# Altium schematic sheet eMMC.SchDoc: eMMC
size A3; CompanyName: STMicroelectronics; Address1: 12, Rue Jules HOROWITZ; Address2: 38019 Grenoble; Address3: FRANCE; SheetNumber: 6; SheetTotal: 7
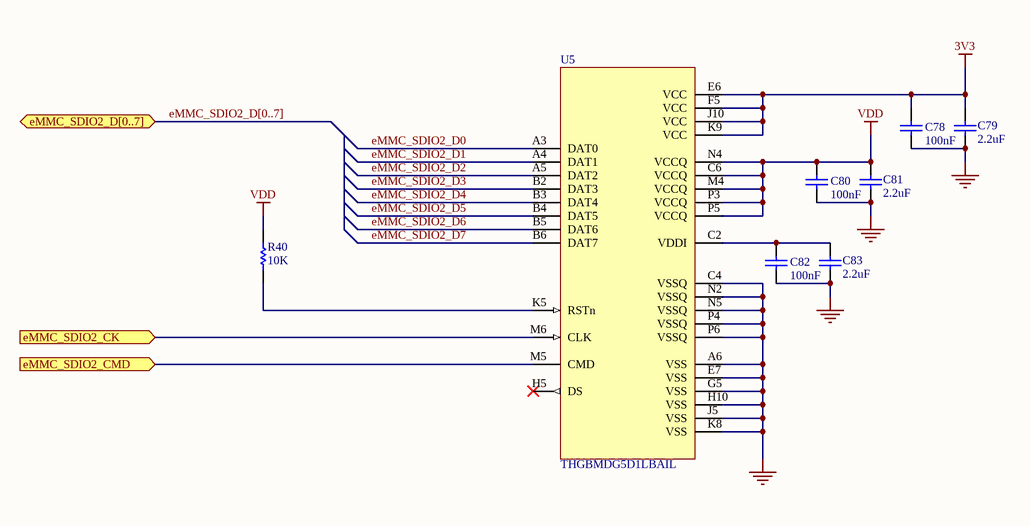
[diagram p0: eMMC.SchDoc]

## Parts
C78  value 100nF  [C0402]
C79  value 2.2uF  [C0603]
C80  value 100nF  [C0402]
C81  value 2.2uF  [C0603]
C82  value 100nF  [C0402]
C83  value 2.2uF  [C0603]
R40  value 10K  [R0402]
U5  value THGBMDG5D1LBAIL  [ICC_P-WFBGA153_13X11P5_P050]

## Ports
eMMC_SDIO2_CK (in), eMMC_SDIO2_CMD (in), eMMC_SDIO2_D[0..7] (bidir)

## Nets
3V3: C78.2 C79.2 U5.E6(VCC) U5.F5(VCC) U5.J10(VCC) U5.K9(VCC)
GND: C78.1 C79.1 C80.1 C81.1 C82.1 C83.1 U5.A6(VSS) U5.C4(VSSQ) U5.E7(VSS) U5.G5(VSS) U5.H10(VSS) U5.J5(VSS) U5.K8(VSS) U5.N2(VSSQ) U5.N5(VSSQ) U5.P4(VSSQ) U5.P6(VSSQ)
VDD: C80.2 C81.2 R40.2 U5.C6(VCCQ) U5.M4(VCCQ) U5.N4(VCCQ) U5.P3(VCCQ) U5.P5(VCCQ)
eMMC_SDIO2_CK: U5.M6(CLK) ; port eMMC_SDIO2_CK
eMMC_SDIO2_CMD: U5.M5(CMD) ; port eMMC_SDIO2_CMD
eMMC_SDIO2_D0: U5.A3(DAT0)
eMMC_SDIO2_D1: U5.A4(DAT1)
eMMC_SDIO2_D2: U5.A5(DAT2)
eMMC_SDIO2_D3: U5.B2(DAT3)
eMMC_SDIO2_D4: U5.B3(DAT4)
eMMC_SDIO2_D5: U5.B4(DAT5)
eMMC_SDIO2_D6: U5.B5(DAT6)
eMMC_SDIO2_D7: U5.B6(DAT7)
NetC82_2: C82.2 C83.2 U5.C2(VDDI)
NetR40_1: R40.1 U5.K5(RSTn)

Not connected (* = marked no-connect by the designer): U5 H5(DS)*

## Buses and harness runs
bus eMMC_SDIO2_D[0..7] = port eMMC_SDIO2_D[0..7]

## Notes on the sheet
- Title:
- Project:
- Size:
- Revision:
- Variant:
- A3
- -
- Date:
- Reference:
- Sheet:
- of

## Library data of the parts
C78 C80 C82 = MCD-00006: Capacitor, MLCC, 100nF, 16V, X7R, 10%, 0402, T=0.5mm; Manufacturer_Part_Number: CC0402KRX7R7BB104; Manufacturer: YAGEO; Alternate_Manufacturer_Part_Number: GCM155R71C104KA55D; Alternate_Manufacturer: MURATA; Provided_By: SUBCO; ECCN_US: EAR99; ECCN_EU: NEC; Internal_Part_Number: MCD-00006; Status: Released; Part_Type: Capacitor; Package: C0402; ComponentLink1Description: Datasheet; ComponentLink1URL: http://tunmcdsvn.tun.st.com/Component_Datasheet_Library/Trunk/Capacitors/Yageo_Multilayer_Capacitor_X7R_series_100pF_to_22uF
C79 C81 C83 = MCD-00012: Capacitor, MLCC, 2.2uF, 10V, X5R, 10%, 0603, T=0,8mm; Manufacturer_Part_Number: CC0603KRX5R6BB225; Manufacturer: YAGEO; Alternate_Manufacturer_Part_Number: C0603C225K8PACTU; Alternate_Manufacturer: KEMET; Provided_By: SUBCO; ECCN_US: EAR99; ECCN_EU: NEC; Internal_Part_Number: MCD-00012; Status: Released; Part_Type: Capacitor; Package: C0603; ComponentLink1Description: Datasheet; ComponentLink1URL: http://tunmcdsvn.tun.st.com/Component_Datasheet_Library/Trunk/Capacitors/Yageo_Multilayer_capacitor_X5R_series_100pF_to_100uF
R40 = MCD-00053: Resistor,10K,0402,1%,1/16W; Manufacturer_Part_Number: RC0402FR-0710KL; Manufacturer: YAGEO; Provided_By: SUBCO; ECCN_US: EAR99; ECCN_EU: NEC; Internal_Part_Number: MCD-00053; Status: Released; Part_Type: Resistor; Package: R0402; ComponentLink1Description: Datasheet; ComponentLink1URL: http://tunmcdsvn.tun.st.com/Component_Datasheet_Library/Trunk/Resistors/Yageo_Resistor_RC0402-series
U5 = MCD-00110: Memory,e-MMC,4GB,3V3,WFBGA,153pins; Part_Type: IC; Manufacturer: TOSHIBA; Provided_By: SUBCO; ECCN_US: 3A991; ECCN_EU: NEC; Internal_Part_Number: MCD-00110; Status: Released; Manufacturer_Part_Number: THGBMDG5D1LBAIL; ComponentLink1Description: Datasheet; ComponentLink1URL: http://tunmcdsvn.tun.st.com/Component_Datasheet_Library/Trunk/IC/Toshiba_eMMC_THGBMDG5D1LBAIL_20151201